# EAGLE design RC Kill Switch (EAGLE 5.11)
BOM: EXCLUDE; DATABASE: ./../PARTSDB.txt; PARTNO: 1193970
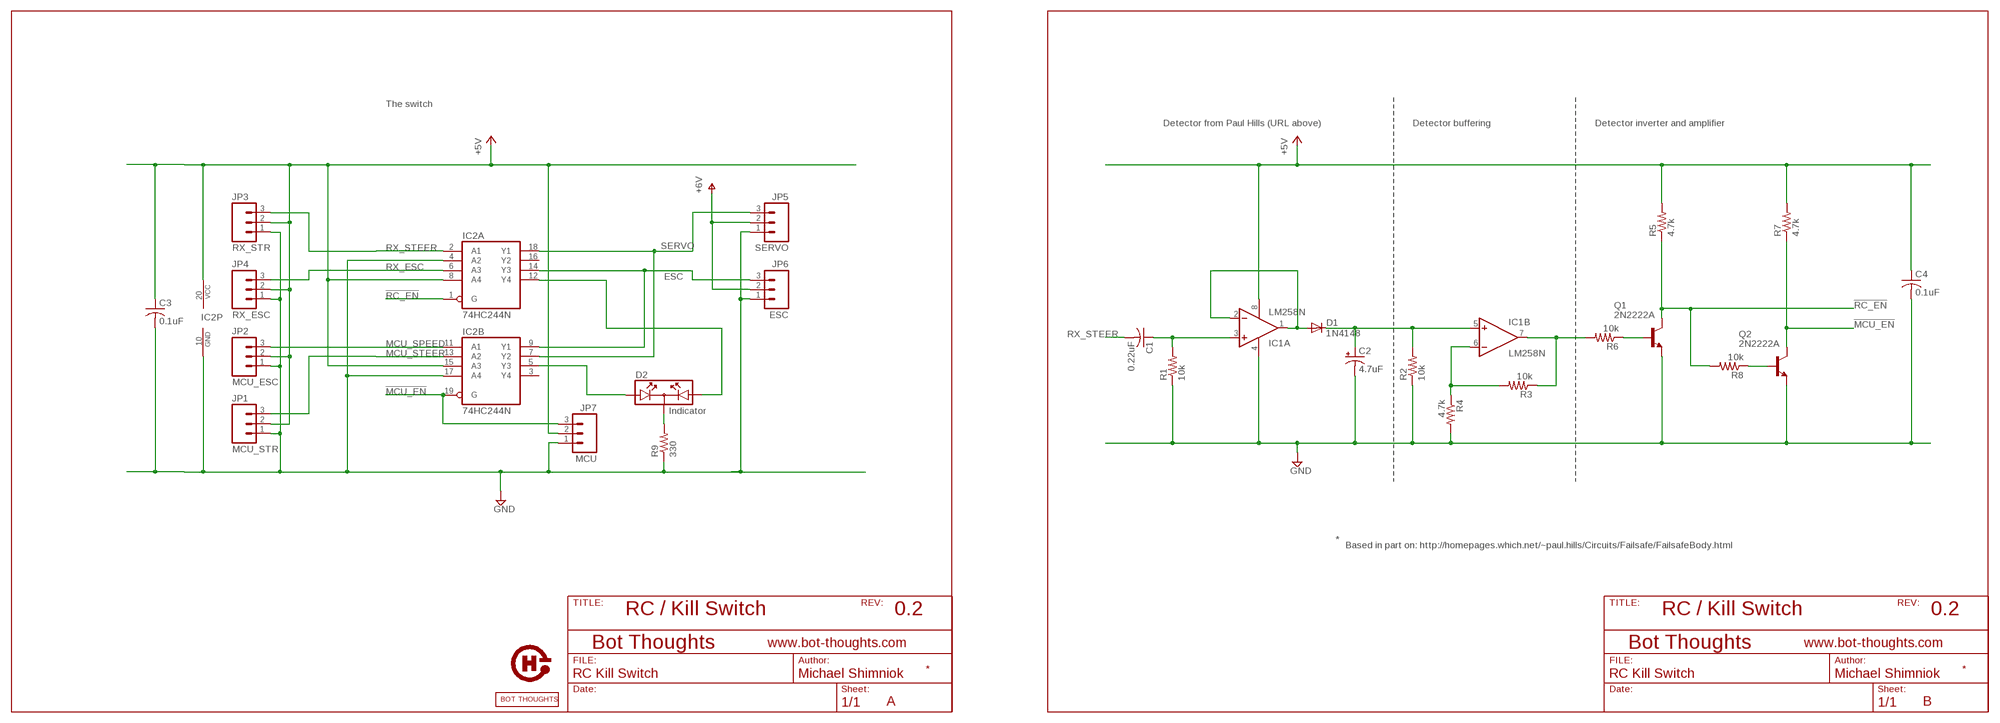
[diagram p0: schematic, sheet 1]

## Parts
C1  0.22uF  C-USC0603  [C0603]
C2  4.7uF  CPOL-USE2-4  [E2-4]
C3  0.1uF  C-USC0603  [C0603]
C4  0.1uF  C-USC0603  [C0603]
D1  1N4148  DIODE-D-5  [D-5]
D2  Indicator  DUOLED  [DUOLED]
IC1  LM258N  LM1458N  [DIL08]
IC2  74HC244N  74LS244N  [DIL20]
JP1  MCU_STR  M03PTH  [1X03]
JP2  MCU_ESC  M03PTH  [1X03]
JP3  RX_STR  M03PTH  [1X03]
JP4  RX_ESC  M03PTH  [1X03]
JP5  SERVO  M03PTH  [1X03]
JP6  ESC  M03PTH  [1X03]
JP7  MCU  M03PTH  [1X03]
Q1  2N2222A  2N3904SMD  [SOT-23]
Q2  2N2222A  2N3904SMD  [SOT-23]
R1  10k  R-US_R0603  [R0603]
R2  10k  R-US_R0603  [R0603]
R3  10k  R-US_R0603  [R0603]
R4  4.7k  R-US_R1206  [R1206]
R5  4.7k  R-US_R0603  [R0603]
R6  10k  R-US_R0603  [R0603]
R7  4.7k  R-US_R0603  [R0603]
R8  10k  R-US_R1206  [R1206]
R9  330  R-US_R0603  [R0603]
U$1  BOT-THOUGHTS  [BOT-THOUGHTS]
U$2  OSHW-LOGO  [OSHW-LOGO]

## Nets
!MCU_EN: IC2.19(B:G) JP7.3 Q2.1(C) R7.1
!RC_EN: IC2.1(A:G) Q1.1(C) R5.1 R8.2
+5V: C3.1 C4.1 IC1.8(P:V+) IC2.8(A:A4) IC2.15(B:A3) IC2.20(P:VCC) JP1.2 JP2.2 JP3.2 JP4.2 JP7.2 R5.2 R7.2
ESC: IC2.9(B:Y1) IC2.14(A:Y3) JP6.3
GND: C2.- C3.2 C4.2 IC1.4(P:V-) IC2.4(A:A2) IC2.10(P:GND) IC2.17(B:A4) JP1.1 JP2.1 JP3.1 JP4.1 JP5.1 JP6.1 JP7.1 Q1.2(E) Q2.2(E) R1.1 R2.1 R4.2 R9.1
MCU_SPEED: IC2.13(B:A2) JP1.3
MCU_STEER: IC2.11(B:A1) JP2.3
N$1: D1.A IC1.1(A:OUT) IC1.2(A:-IN)
N$2: C2.+ D1.C IC1.5(B:+IN) R2.2
N$3: IC1.6(B:-IN) R3.2 R4.1
N$4: IC1.7(B:OUT) R3.1 R6.2
N$5: C1.1 IC1.3(A:+IN) R1.2
N$6: Q2.3(B) R8.1
N$8: Q1.3(B) R6.1
N$9: D2.A1 IC2.5(B:Y3)
N$10: D2.A2 IC2.12(A:Y4)
N$11: D2.K R9.2
RX_ESC: IC2.6(A:A3) JP4.3
RX_STEER: C1.2 IC2.2(A:A1) JP3.3
SERVO: IC2.7(B:Y2) IC2.18(A:Y1) JP5.3
V+: JP5.2 JP6.2 ; supply symbol labelled +6V
Unconnected: IC2.3(B:Y4) IC2.16(A:Y2)

## Notes on the sheet
- The switch
- Detector from Paul Hills (URL above) | Detector buffering | Detector inverter and amplifier
- *
- Based in part on: http://homepages.which.net/~paul.hills/Circuits/Failsafe/FailsafeBody.html
- RC / Kill Switch | 0.2 | RC / Kill Switch | 0.2
- * | *
- A | B

## Library data of the parts
C1 C3 C4 = rcl:C-US: CAPACITOR, American symbol
C2 = rcl:CPOL-US: POLARIZED CAPACITOR, American symbol
D1 = diode:DIODE-: DIODE
D2 = special:DUOLED: Duo LED
IC1 = linear:*1458: OP AMP
IC2 = 74xx-us:74*244: Octal BUFFER and LINE DRIVER, 3-state
JP1-JP7 = SparkFun:M03: Header 3 Standard 3-pin 0.1" header. Use with straight break away headers (SKU : PRT-00116), right angle break away headers (PRT-00553), swiss pins (PRT-00743), machine pins (PRT-00117), and female headers (PRT-00115). Molex polarized connector foot print use with SKU : PRT-08232 with associated crimp pins and housings.
Q1 Q2 = mes:2N3904: NPN Transistor Small signal NPN Bipolar Junction Transistor (BJT). Use this device to represent any of a number of such transistors with similar package and pinout: 2N4401, 2N3904, 2N2222, etc.
R1-R9 = rcl:R-US_: RESISTOR, American symbol
U$1 = mes:BOT-THOUGHTS
U$2 = SparkFun:OSHW-LOGO: Open Source Hardware Logo This logo indicates the piece of hardware it is found on incorporates a OSHW license and/or adheres to the definition of open source hardware found here: http://freedomdefined.org/OSHW

## Board
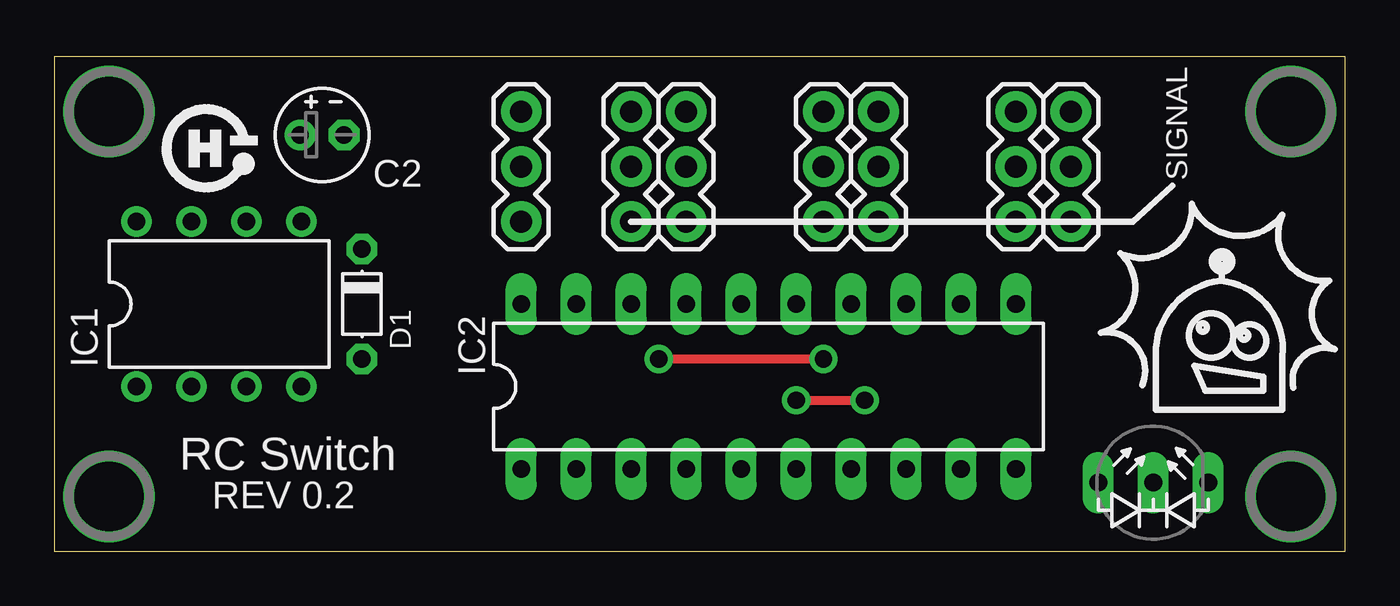
[diagram p1: board, top side]
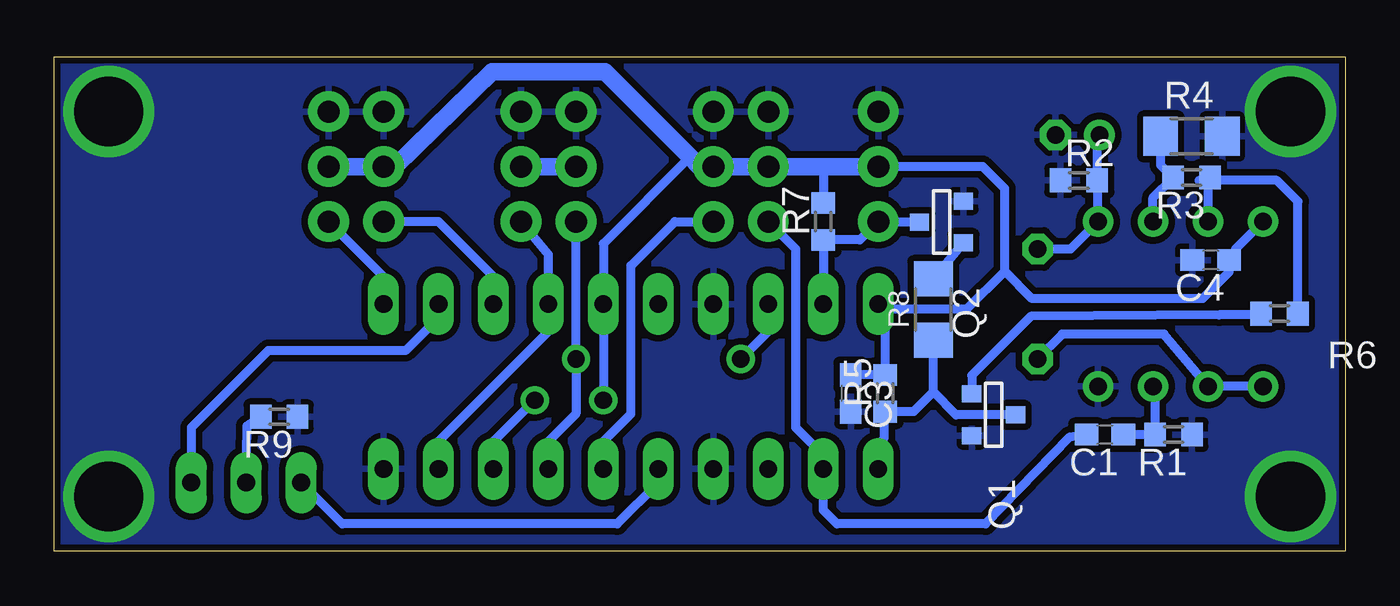
[diagram p2: board, bottom side, seen from below]

Size 59.68 x 22.85 mm. Coordinates in mm from the lower left corner, seen from the top.
Outline: 0,0 59.68,0 59.68,22.85 0,22.85 0,0
Copper layers (1*16): Top 0.035mm / dielectric 1.5mm / Bottom 0.035mm
Design rules "SparkFun": minimum track width 8mil, minimum drill 20mil, track to track 8mil, track to pad 8mil, pad to pad 8mil, via to via 8mil, smd to smd 8mil, copper to edge 10mil, drill to drill 8mil, minimum pad ring 12mil, minimum via ring 10mil, stop-mask expansion 4mil, vias tented up to drill 25mil, thermal gap 10mil

### Footprints (pad centres in the part's own frame; a part is rotated, then mirrored left to right if it is on the bottom)
C0603 = smd 1.1 x 1: 1 -0.85,0; 2 0.85,0
E2-4 = drill 0.813 pad 1.27 round: + -1.016,0 | drill 0.813 pad 1.27 octagon: - 1.016,0
D-5 = drill 0.813 octagon: A 2.54,0; C -2.54,0
DUOLED = drill 0.813 long: A1 -3.81,0; A2 1.27,0; K -1.27,0
DIL08 = drill 0.813 pad 1.27 round: 1 -3.81,-3.81; 2 -1.27,-3.81; 3 1.27,-3.81; 4 3.81,-3.81; 5 3.81,3.81; 6 1.27,3.81; 7 -1.27,3.81; 8 -3.81,3.81
DIL20 = drill 0.813 long: 1 -11.43,-3.81; 2 -8.89,-3.81; 3 -6.35,-3.81; 4 -3.81,-3.81; 5 -1.27,-3.81; 6 1.27,-3.81; 7 3.81,-3.81; 8 6.35,-3.81; 9 8.89,-3.81; 10 11.43,-3.81; 11 11.43,3.81; 12 8.89,3.81; 13 6.35,3.81; 14 3.81,3.81; 15 1.27,3.81; 16 -1.27,3.81; 17 -3.81,3.81; 18 -6.35,3.81; 19 -8.89,3.81; 20 -11.43,3.81
1X03 = drill 1.016 pad 1.88 round: 1 0,0; 2 2.54,0; 3 5.08,0
SOT-23 = smd 0.787 x 0.889: 1 0.025,-1.016; 2 -0.94,1.016; 3 0.991,1.016
R0603 = smd 1 x 1.1: 1 -0.85,0; 2 0.85,0
R1206 = smd 1.6 x 1.803: 1 -1.422,0; 2 1.422,0

### Placement (x,y rotation side)
C1  11.11,5.4 180 bottom
C2  12.38,19.24 0 top
C3  22.86,7.3 270 bottom
C4  6.22,13.46 180 bottom
D1  14.22,11.43 270 top
D2  52.07,3.17 0 top
IC1  7.62,11.43 0 top
IC2  33.02,7.62 0 top
JP1  44.45,20.32 270 top
JP2  46.99,20.32 270 top
JP3  26.67,20.32 270 top
JP4  29.21,20.32 270 top
JP5  35.56,20.32 270 top
JP6  38.1,20.32 270 top
JP7  21.59,20.32 270 top
Q1  16.26,6.29 90 bottom
Q2  18.67,15.24 270 bottom
R1  7.94,5.4 180 bottom
R2  12.32,17.14 0 bottom
R3  7.11,17.27 180 bottom
R4  7.11,19.18 0 bottom
R5  21.27,7.3 90 bottom
R6  3.05,10.99 0 bottom
R7  24.13,15.24 90 bottom
R8  19.05,11.18 270 bottom
R9  49.28,6.22 180 bottom
U$1  54.23,8.83 0 top
U$2  6.99,18.67 0 top

### Tracks (layer width: path | path; a pad name or v marks a point on that pad's centre or on a via)
!MCU_EN
  Bottom 0.406: IC2.19 R7.1 22.44,14.39 JP7.3 21.57,15.21 Q2.1
!RC_EN
  Bottom 0.406: IC2.1 21.59,4.83 21.34,5.21 21.34,6.39 R5.1 | R5.1 21.13,6.31 | R5.1 19.96,6.45 19.05,7.37 | 19.05,7.37 R8.2 | Q1.1 18,6.31 19.05,7.37
+5V  (via drill 0.8)
  Top 0.406: v34.29,6.99 v37.47,6.99
  Bottom 0.406: 24.13,17.78 R7.2 | IC2.8 39.37,5.08 v37.47,6.99 | C3.1 R5.2 21.27,10.6 21.59,10.92 21.59,11.01 IC2.20 21.34,11.18 17.53,11.18 15.75,12.95 | 30.29,18.22 34.29,14.22 IC2.15 v34.29,6.99 | IC1.8 5.08,13.97 5.08,13.5 C4.1 5.37,12.91 6.6,11.68 14.48,11.68 15.75,12.95 | JP7.2 20.32,17.78 19.3,17.78 16.76,17.78 15.75,16.76 15.75,15.75 15.75,14.73 15.75,14.22 15.75,12.95
  Bottom 0.813: JP7.2 22.86,17.78 24.13,17.78 JP3.2 JP4.2 29.84,17.78 30.29,18.22 34.23,22.16 39.43,22.16 43.94,17.78 JP1.2 JP2.2
ESC
  Bottom 0.406: JP6.3 36.83,13.72 IC2.14 36.83,10.16 41.91,5.08 IC2.9
GND  (via drill 3.2)
  other vias: 2.54,20.32 2.54,2.54 57.15,2.54 57.15,20.32
  pour Bottom (isolate 0.305, rank 2): 0,0 59.69,0 59.69,22.86 0,22.86
MCU_SPEED
  Bottom 0.406: IC2.13 39.37,12.7 41.66,14.99 41.91,15.24 JP1.3
MCU_STEER
  Bottom 0.406: JP2.3 44.45,12.7 IC2.11
N$1
  Bottom 0.406: IC1.1 IC1.2 8.38,10.03 13.08,10.03 D1.A
N$2
  Bottom 0.406: 11.43,15.21 IC1.5 | D1.C 12.7,13.97 IC1.5 | IC1.5 11.43,17.11 R2.2 11.47,19.14 C2.+
N$3
  Bottom 0.406: 9.06,15.07 IC1.6 8.89,16.34 R3.2 8.53,17.84 R4.1
N$4
  Bottom 0.406: 6.2,15.09 IC1.7 6.35,16.73 R3.1 6.77,17.14 3.17,17.14 2.2,16.17 R6.2
N$5
  Bottom 0.406: C1.1 R1.2 8.79,7.52 IC1.3
N$6
  Bottom 0.406: Q2.3 18.92,12.72 R8.1
N$8
  Bottom 0.406: Q1.3 17.27,8.13 14.54,10.86 5.84,10.92 3.96,10.92 R6.1
N$9
  Bottom 0.406: IC2.5 31.75,3.17 33.66,1.27 46.35,1.27 46.99,1.91 D2.A1
N$10
  Bottom 0.406: IC2.12 41.91,10.79 43.43,9.27 49.78,9.27 53.34,5.71 D2.A2
N$11
  Bottom 0.406: R9.2 50.76,5.8 D2.K
RX_ESC
  Bottom 0.406: JP4.3 30.99,15.24 33.02,13.21 33.02,6.35 34.29,5.08 IC2.6
RX_STEER
  Bottom 0.406: C1.2 12.76,5.27 16.64,1.27 23.5,1.27 24.13,1.91 IC2.2 24.13,4.45 25.4,5.71 25.4,13.97 JP3.3
SERVO  (via drill 0.8)
  Top 0.406: v27.94,8.89 v35.56,8.89
  Bottom 0.406: JP5.3 35.56,13.97 v35.56,8.89 35.56,6.35 36.83,5.08 IC2.7 | IC2.18 26.67,10.16 v27.94,8.89
V+
  Bottom 0.813: JP5.2 JP6.2

### Text on the board
tNames: SIGNAL | RC Switch | REV 0.2
tValues: WWW.BOT-THOUGHTS.COM